# Altium schematic sheet amplifier.SchDoc
size A4
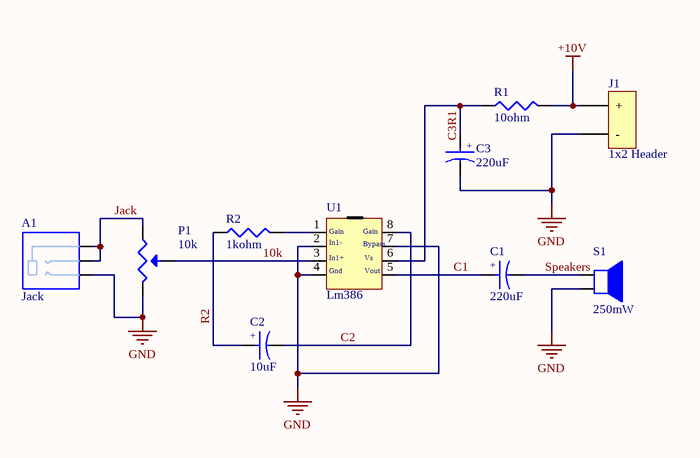
[diagram p0: amplifier.SchDoc]

## Parts
A1  Jack  [SJ252]
C1  220uF  [C6SVPE]
C2  10uF  [C10SVP]
C3  220uF  [C6SVPE]
J1  1x2 Header  [HDR1x2]
P1  10k  [91A1A]
R1  10ohm  [R0402]
R2  1kohm  [R0603]
S1  250mW  [CLF038]
U1  Lm386  [LM386MX]

## Nets
+10V: J1.1(+) R1.2
GND: A1.3 C3.2 J1.2(-) P1.2 S1.2 U1.2 U1.4 U1.7
10k: P1.3 U1.3
C1: C1.1 U1.5
C2: C2.2 U1.8
Jack: A1.1 A1.2 P1.1
R2: C2.1 R2.1
Speakers: C1.2 S1.1
NetC3_1: C3.1 R1.1 U1.6
NetR2_2: R2.2 U1.1

## Notes on the sheet
- Labels drawn without touching a wire or pin: C3R1
- (in symbol 6SVPE220MW) +
- (in symbol 10SVP10M) +
- (in symbol LM386MX-1/NOPB) Gain; In1-; Bypass; In1+; Vs; Gnd; Vout

## Library data of the parts
A1 = SJ-2523-SMT-TR: 2.50mm (0.094", 3/32", Sub Mini, Miniature) - Headphone Phone Jack Stereo Connector Solder; Manufacturer: CUI; Gender: Female; Shielding: Unshielded; Current Rating: 1A; Supplier 1: Digi-Key; Supplier Part Number 1: CP-2523SJDKR-ND; Manufacturer Part Number: SJ-2523-SMT-TR; Stock 1: 99414; Pricing 1: 1=0.96, 10=0.842, 25=0.792, 50=0.759, 100=0.726, 250=0.66, 500=0.594 (USD); Mount: Surface Mount; Case/Package: SMD/SMT; Contact Plating: Silver; Packaging: Cut Tape; Termination: Solder; Lead Free: Lead Free; ComponentLink1URL: https://www.cui.com/product/resource/digikeypdf/sj-252x-smt_series.pdf; ComponentLink1Description: https://www.cui.com/product/resource/digikeypdf/sj-252x-smt_series.pdf; Category: Connectors
C1 C3 = 6SVPE220MW: Cap Aluminum Polymer 220uF 6.3VDC 20% (5 X 5.9mm) SMD 0.015 Ohm 3150mA 2000h 105C T/R; Manufacturer: Panasonic; Ripple Current (AC): 3.15A; ESR (Equivalent Series Resistance): 15mR; Voltage Rating: 6.3V; Leakage Current: 500uA; Polarity: Polar; Life (Hours): 2000Hour; Dissipation Factor: 12%; Supplier 1: Digi-Key; Supplier Part Number 1: P16836DKR-ND; Manufacturer Part Number: 6SVPE220MW; Stock 1: 8702; Pricing 1: 1=0.68, 10=0.503, 100=0.3452, 500=0.27326 (USD); Mount: Surface Mount; Case/Package: Radial; Number of Pins: 6; Min Operating Temperature: -55°C; Max Operating Temperature: 105°C; Packaging: Tape and Reel; Capacitance: 220uF; Tolerance: 20%; Package Quantity: 1500; Ripple Current: 3.15A; Voltage Rating (DC): 6.3V; Termination: SMD/SMT; Voltage: 6.3V; Diameter: 5mm; Length: 5.9mm; Height: 5.9mm; Height - Seated (Max): 0.236inch; REACH SVHC: No SVHC; Lead Free: Lead Free; ComponentLink1URL: http://www.farnell.com/datasheets/1734359.pdf; ComponentLink1Description: http://www.farnell.com/datasheets/1734359.pdf; ComponentLink2URL: http://www.farnell.com/datasheets/2059644.pdf; ComponentLink2Description: http://www.farnell.com/datasheets/2059644.pdf; Category: Capacitors
C2 = 10SVP10M: CAP POLYMER 10UF 20% 10V SMD; Manufacturer: Panasonic; Ripple Current: 700mA; ESR (Equivalent Series Resistance): 220mR; Leakage Current: 50uA; Polarity: Polar; Life (Hours): 2000Hour; Dissipation Factor: 10%; Supplier 1: Digi-Key; Supplier Part Number 1: P16427DKR-ND; Manufacturer Part Number: 10SVP10M; Stock 1: 5849; Pricing 1: 1=1.11, 10=0.874, 100=0.6556, 500=0.49532, 1000=0.43705 (USD); Mount: Surface Mount; Case/Package: Radial; Number of Pins: 5; Material: Polymer; Min Operating Temperature: -55°C; Max Operating Temperature: 105°C; Tolerance: 20%; Capacitance: 10uF; Packaging: Tape and Reel; Voltage Rating: 10V; Ripple Current (AC): 700mA; Voltage Rating (DC): 10V; Package Quantity: 1; Termination: SMD/SMT; Voltage: 10V; Diameter: 4mm; Length: 5.4mm; Height: 5.4mm; Height - Seated (Max): 0.217inch; Radiation Hardening: No; REACH SVHC: No SVHC; Lead Free: Lead Free; Category: Capacitors
J1 = 22-29-2021: Headers & Wire Housings 2 PIN F/LK HEADER; Manufacturer: Molex; Number of Positions: 2; Gender: Male; Contact Resistance: 10mR; Current Rating: 4A; Voltage Rating: 250V; Pitch: 2.54mm; Glow Wire Compliant: Non-compliant; Supplier 1: Digi-Key; Supplier Part Number 1: WM2744-ND; Manufacturer Part Number: 22-29-2021; Stock 1: 11534; Pricing 1: 1=0.48, 10=0.452, 100=0.3163, 500=0.27112, 1000=0.22593, 5000=0.19365, 10000=0.18074 (USD); Mount: Through Hole; Housing Color: White; Color: White; Housing Material: Nylon; Contact Plating: Gold; Contact Material: Brass; Min Operating Temperature: 0°C; Max Operating Temperature: 75°C; Number of Rows: 1; Packaging: Bulk; Termination: Through Hole; Orientation: Straight; Number of Contacts: 2; Package Quantity: 2500; Number of Circuits: 2; Max Current Rating: 4A; Max Voltage Rating (AC): 250V; Voltage Rating (DC): 250V; Length: 12.7mm; Height: 11.7mm; Depth: 5.8mm; Radiation Hardening: No; Lead Free: Lead Free; REACH SVHC: Unknown; Halogen Free: Low Halogen; Flammability Rating: UL94 V-0; ComponentLink1URL: http://www.jameco.com/Jameco/Products/ProdDS/879588.pdf; ComponentLink1Description: http://www.jameco.com/Jameco/Products/ProdDS/879588.pdf; ComponentLink2URL: http://uk.rs-online.com/webdocs/13c2/0900766b813c2e8d.pdf; ComponentLink2Description: http://uk.rs-online.com/webdocs/13c2/0900766b813c2e8d.pdf; ComponentLink3URL: http://www.mouser.com/ds/2/276/0022292021_PCB_HEADERS-159390.pdf; ComponentLink3Description: http://www.mouser.com/ds/2/276/0022292021_PCB_HEADERS-159390.pdf; ComponentLink4URL: http://www.molex.com/webdocs/datasheets/pdf/en-us/0022292021_PCB_HEADERS.pdf; ComponentLink4Description: http://www.molex.com/webdocs/datasheets/pdf/en-us/0022292021_PCB_HEADERS.pdf; Category: Connectors
P1 = 91A1A-B28-B15L: BOURNS   91A1A-B28-B15L   Rotary Potentiometer, Conductive Plastic, 91 Series, 10 kohm, Linear, 1 Turns, 1 W, Through Hole; Resistance: 10kR; Tolerance: 20%; Power Rating: 1W; Number of Turns: 1; Temperature Coefficient: 1000ppm/°C; Linearity: 5%; Voltage Rating (DC): 500V; Voltage Rating (AC): 350V; Actuator Length: 0.875inch; Actuator Diameter: 0.25inch; Hole Diameter: 9.525mm; Ratings: IP40; Supplier 1: Digi-Key; Supplier Part Number 1: 91A1A-B28-B15L-ND; Manufacturer: Bourns; Manufacturer Part Number: 91A1A-B28-B15L; Stock 1: 9322; Pricing 1: 1=5.91, 10=5.418, 25=4.8264, 50=4.531, 100=4.137, 250=3.349, 500=3.152, 1000=2.955 (USD); Mount: Panel,Through Hole; Weight: 12.7g; Contact Plating: Tin; Min Operating Temperature: -40°C; Max Operating Temperature: 125°C; Package Quantity: 5; Packaging: Bulk; Composition: Conductive Plastic; Taper: Linear; Termination: Pin; Number of Gangs: 1; Military Standard: Not; Max Power Dissipation: 1W; Type: Potentiometer; Length: 34.93mm; Height: 17.47mm; Width: 15.88mm; Depth: 15.88mm; Radiation Hardening: No; REACH SVHC: No SVHC; Lead Free: Lead Free; ComponentLink1URL: https://www.verical.com/server-webapp/html/getDatasheet?partID=30645; ComponentLink1Description: https://www.verical.com/server-webapp/html/getDatasheet?partID=30645; ComponentLink2URL: http://uk.rs-online.com/webdocs/06d6/0900766b806d6d25.pdf; ComponentLink2Description: http://uk.rs-online.com/webdocs/06d6/0900766b806d6d25.pdf; ComponentLink3URL: https://www.bourns.com/docs/Product-Datasheets/91_95.pdf; ComponentLink3Description: https://www.bourns.com/docs/Product-Datasheets/91_95.pdf; ComponentLink4URL: https://www.distrelec.biz/Web/Downloads/_t/ds/91-95-series_eng_tds.pdf?mime=application%2Fpdf; ComponentLink4Description: https://www.distrelec.biz/Web/Downloads/_t/ds/91-95-series_eng_tds.pdf?mime=application%2Fpdf; ComponentLink5URL: http://components.arrow.com/part/dataview/42911771S9459740N1506; ComponentLink5Description: http://components.arrow.com/part/dataview/42911771S9459740N1506; Category: Potentiometers
R1 = CRCW040210R0FKEDHP: Thick Film Resistors 0.2W 10ohms 1% High Power AEC-Q200; Manufacturer: Vishay Dale; Resistance: 10R; Power Rating: 125mW; Voltage Rating: 50V; Temperature Coefficient: 100ppm/°C; Supplier 1: Digi-Key; Supplier Part Number 1: 541-10.0YDKR-ND; Manufacturer Part Number: CRCW040210R0FKEDHP; Stock 1: 27988; Pricing 1: 1=0.15, 10=0.138, 100=0.0532, 1000=0.02343, 2500=0.02023, 5000=0.0181 (USD); Mount: Surface Mount; Case/Package: 0402; Weight: 2.3E-05oz; Case Code (Imperial): 0402; Case Code (Metric): 1005; Contact Plating: Tin; Min Operating Temperature: -55°C; Max Operating Temperature: 155°C; Tolerance: 1%; Packaging: Tape and Reel; Package Quantity: 10000; Termination: SMD/SMT; Composition: Thick Film; Voltage Rating (DC): 50V; Military Standard: Not; Length: 1mm; Height: 0.3mm; Width: 0.5mm; Depth: 0.5mm; Radiation Hardening: No; REACH SVHC: Unknown; Lead Free: Lead Free; ComponentLink1URL: http://www.mouser.com/ds/2/427/crcwhpe3-46056.pdf; ComponentLink1Description: http://www.mouser.com/ds/2/427/crcwhpe3-46056.pdf; Category: Resistors
R2 = TNPU06031K00BZEN00: Thin Film Resistors - SMD 1/10watt 1Kohms 0.1% 5ppm; Manufacturer: Vishay Dale; Power Rating: 100mW; Resistance: 1kR; Voltage Rating: 75V; Temperature Coefficient: 5ppm/°C; Supplier 1: Digi-Key; Supplier Part Number 1: TNPU1.00KBADKR-ND; Manufacturer Part Number: TNPU06031K00BZEN00; Stock 1: 22594; Pricing 1: 1=2.45, 10=2.176, 100=1.6617 (USD); Case/Package: 0603; Number of Pins: 2; Case Code (Metric): 1608; Case Code (Imperial): 0603; Min Operating Temperature: -55°C; Max Operating Temperature: 125°C; Packaging: Tape and Reel; Tolerance: 0.1%; Composition: Thin Film; Termination: SMD/SMT; Voltage Rating (DC): 75V; Package Quantity: 1; Number of Terminations: 2; Max Power Dissipation: 100mW; Features: Anti-Sulfur,Automotive AEC-Q200,Moisture Resistant; Length: 1.6mm; Height: 0.45mm; Width: 0.033inch; Depth: 0.85mm; Radiation Hardening: No; REACH SVHC: Unknown; Lead Free: Lead Free; ComponentLink1URL: http://www.vishay.com/docs/28779/tnpue3.pdf; ComponentLink1Description: http://www.vishay.com/docs/28779/tnpue3.pdf; ComponentLink2URL: http://uk.rs-online.com/webdocs/0d9a/0900766b80d9a43e.pdf; ComponentLink2Description: http://uk.rs-online.com/webdocs/0d9a/0900766b80d9a43e.pdf; Category: Resistors
S1 = CLF0381MP-1: 8 Ohm Magnetic Speaker 250mW 380Hz ~ 10kHz Top Round 93dB; Manufacturer: CUI; Impedance: 8R; Max Power Dissipation: 400mW; Supplier 1: Digi-Key; Supplier Part Number 1: 102-1549-ND; Manufacturer Part Number: CLF0381MP-1; Stock 1: 7807; Pricing 1: 1=3.56, 10=2.818, 25=2.572, 50=2.4024, 100=2.233, 250=2.0482, 500=2.002 (USD); Shape: Round; Termination: PC Pins; Resistance: 8R; Power Rating: 250mW; Height: 9.7mm; Lead Free: Lead Free; Category: Audio
U1 = LM386MX-1/NOPB: TEXAS INSTRUMENTS   LM386MX-1/NOPB   AUDIO POWER AMPLIFIER, CLASS AB 325mW SOIC-8; Manufacturer: TI National Semiconductor; Number of Channels: 1; Voltage Gain: 46dB; Min Supply Voltage: 4V; Max Supply Voltage: 12V; Operating Supply Voltage: 9V; Max Power Dissipation: 730mW; Nominal Supply Current: 4mA; Gain: 20dB; Power Supply Rejection Ratio (PSRR): 50dB; Input Bias Current: 250nA; Supply Type: Single; Bandwidth: 300kHz; Load Impedance: 8R; Supplier 1: Digi-Key; Supplier Part Number 1: LM386MX-1/NOPBDKR-ND; Manufacturer Part Number: LM386MX-1/NOPB; Stock 1: 22596; Pricing 1: 1=0.91, 10=0.814, 100=0.6349, 500=0.52448, 1000=0.41406 (USD); Case/Package: D; Number of Pins: 8; Contact Plating: Matte,Tin; Min Operating Temperature: 0°C; Max Operating Temperature: 70°C; Output Power: 325mW; Packaging: Tape and Reel; Package Quantity: 2500; Max Output Power: 325mW; Power Dissipation: 730mW; Radiation Hardening: No; REACH SVHC: No SVHC; Lead Free: Lead Free; ComponentLink1URL: http://www.farnell.com/datasheets/1640767.pdf; ComponentLink1Description: http://www.farnell.com/datasheets/1640767.pdf; ComponentLink2URL: http://www.ti.com/general/docs/lit/getliterature.tsp?genericPartNumber=LM386&&fileType=pdf; ComponentLink2Description: http://www.ti.com/general/docs/lit/getliterature.tsp?genericPartNumber=LM386&&fileType=pdf; ComponentLink3URL: http://www.jameco.com/Jameco/Products/ProdDS/1282302.pdf; ComponentLink3Description: http://www.jameco.com/Jameco/Products/ProdDS/1282302.pdf; ComponentLink4URL: https://www.verical.com/server-webapp/html/getDatasheet?partID=145250; ComponentLink4Description: https://www.verical.com/server-webapp/html/getDatasheet?partID=145250; ComponentLink5URL: http://www.ti.com/lit/ds/symlink/lm386.pdf; ComponentLink5Description: http://www.ti.com/lit/ds/symlink/lm386.pdf; Category: Integrated